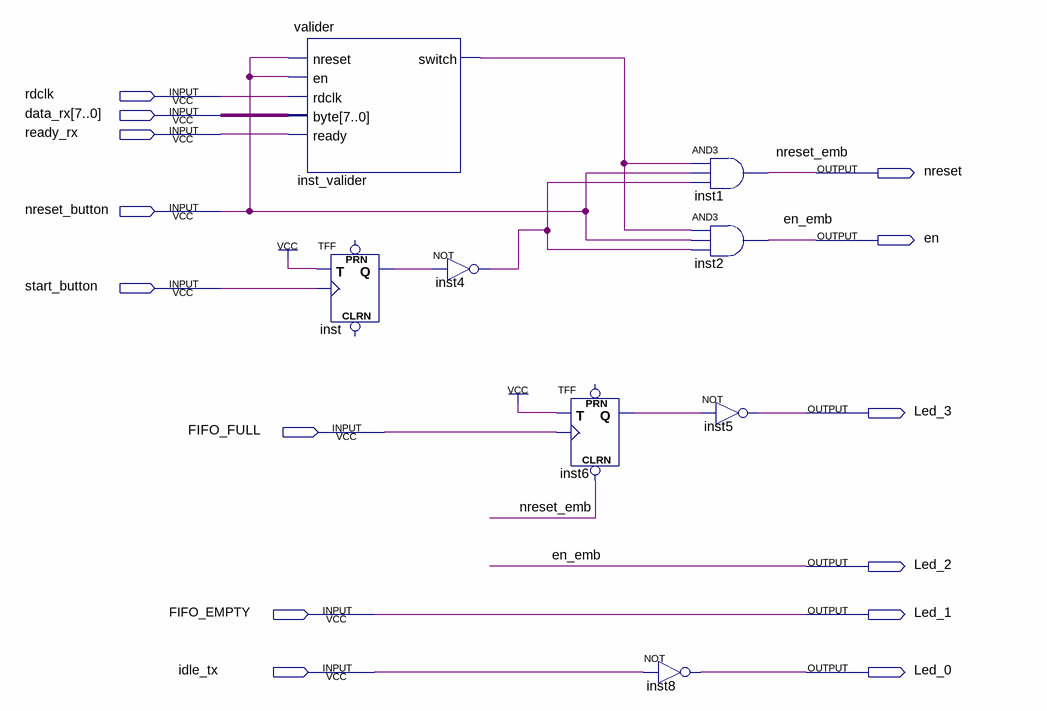
[diagram p0: schematic sheet]
// Quartus schematic COTROL_CIRCUIT.bdf as structural Verilog: 8 symbols, 14 pins
module COTROL_CIRCUIT (
  input  rdclk,
  input  [7:0] data_rx,
  input  ready_rx,
  input  nreset_button,
  input  start_button,
  input  FIFO_FULL,
  input  FIFO_EMPTY,
  input  idle_tx,
  output nreset,
  output en,
  output Led_3,
  output Led_2,
  output Led_1,
  output Led_0
);

  wire inst4_out, inst6_q, inst_q, inst_valider_switch;

  valider inst_valider (
    .nreset(nreset_button), .en(nreset_button), .rdclk(rdclk), .\byte (data_rx), .ready(ready_rx),
    .switch(inst_valider_switch));
  TFF inst (.T(1'b1), .CLK(start_button), .Q(inst_q));  // open: PRN, CLRN
  not inst4 (inst4_out, inst_q);
  TFF inst6 (.CLRN(nreset), .T(1'b1), .CLK(FIFO_FULL), .Q(inst6_q));  // open: PRN
  not inst8 (Led_0, idle_tx);
  and inst1 (nreset, inst_valider_switch, nreset_button, inst4_out);
  and inst2 (en, inst_valider_switch, nreset_button, inst4_out);
  not inst5 (Led_3, inst6_q);

  assign Led_1 = FIFO_EMPTY;
  assign Led_2 = en;

  // Other names for the same wires on the sheet: en_emb = en; nreset_emb = nreset
endmodule
